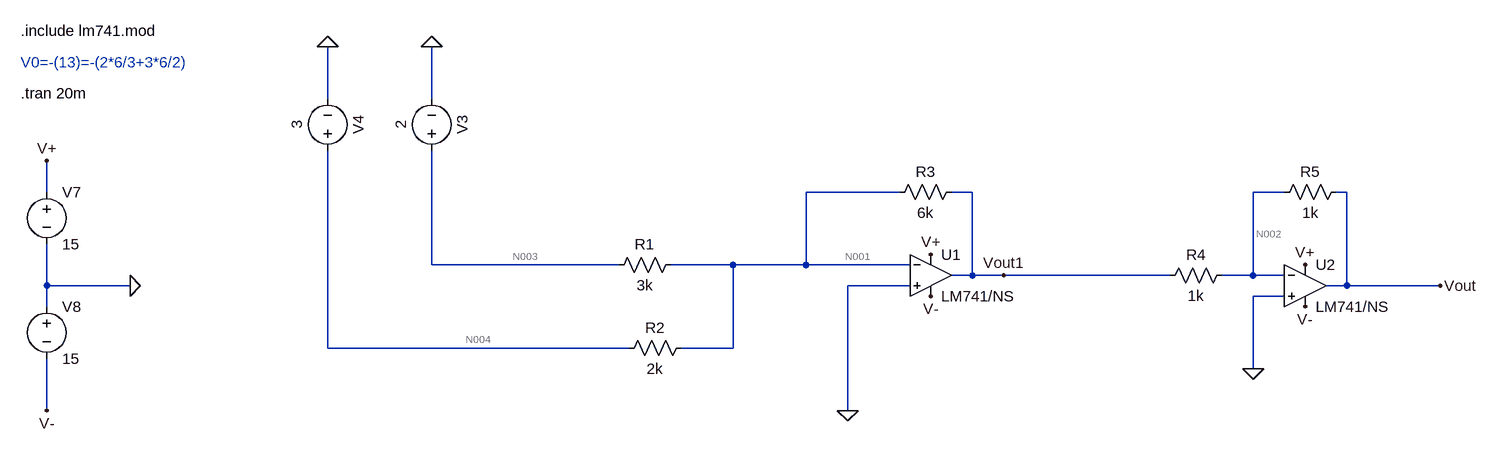
[diagram p0: schematic Scaling adder.asc]
Scaling adder.asc, the LTspice schematic file:
Version 4
SHEET 1 1016 680
WIRE -768 -144 -768 -224
WIRE -608 -144 -608 -224
WIRE -1200 0 -1200 -48
WIRE 112 0 -32 0
WIRE 224 0 192 0
WIRE 704 0 656 0
WIRE 800 0 784 0
WIRE -608 112 -608 -64
WIRE -320 112 -608 112
WIRE -144 112 -240 112
WIRE -32 112 -32 0
WIRE -32 112 -144 112
WIRE 128 112 -32 112
WIRE 224 128 224 0
WIRE 224 128 192 128
WIRE 272 128 224 128
WIRE 528 128 272 128
WIRE 656 128 656 0
WIRE 656 128 608 128
WIRE 704 128 656 128
WIRE -1200 144 -1200 80
WIRE -1072 144 -1200 144
WIRE 128 144 32 144
WIRE 800 144 800 0
WIRE 800 144 768 144
WIRE 944 144 800 144
WIRE 704 160 656 160
WIRE -1200 176 -1200 144
WIRE -768 240 -768 -64
WIRE -304 240 -768 240
WIRE -144 240 -144 112
WIRE -144 240 -224 240
WIRE 656 272 656 160
WIRE -1200 336 -1200 256
WIRE 32 336 32 144
FLAG 272 128 Vout1
FLAG 32 336 0
FLAG -608 -224 0
FLAG -768 -224 0
FLAG 656 272 0
FLAG 944 144 Vout
FLAG -1072 144 0
FLAG 160 96 V+
FLAG -1200 -48 V+
FLAG -1200 336 V-
FLAG 160 160 V-
FLAG 736 176 V-
FLAG 736 112 V+
SYMBOL OpAmps\\opamp2 160 64 R0
SYMATTR InstName U1
SYMATTR Value LM741/NS
SYMBOL res -224 96 R90
WINDOW 0 0 56 VBottom 2
WINDOW 3 32 56 VTop 2
SYMATTR InstName R1
SYMATTR Value 3k
SYMBOL res -208 224 R90
WINDOW 0 0 56 VBottom 2
WINDOW 3 32 56 VTop 2
SYMATTR InstName R2
SYMATTR Value 2k
SYMBOL voltage -608 -48 R180
WINDOW 0 -32 56 VBottom 2
WINDOW 3 32 56 VTop 2
WINDOW 123 0 0 Left 0
WINDOW 39 0 0 Left 0
SYMATTR InstName V3
SYMATTR Value 2
SYMBOL voltage -768 -48 R180
WINDOW 0 -32 56 VBottom 2
WINDOW 3 32 56 VTop 2
WINDOW 123 0 0 Left 0
WINDOW 39 0 0 Left 0
SYMATTR InstName V4
SYMATTR Value 3
SYMBOL res 208 -16 R90
WINDOW 0 0 56 VBottom 2
WINDOW 3 32 56 VTop 2
SYMATTR InstName R3
SYMATTR Value 6k
SYMBOL OpAmps\\opamp2 736 80 R0
SYMATTR InstName U2
SYMATTR Value LM741/NS
SYMBOL res 624 112 R90
WINDOW 0 0 56 VBottom 2
WINDOW 3 32 56 VTop 2
SYMATTR InstName R4
SYMATTR Value 1k
SYMBOL res 800 -16 R90
WINDOW 0 0 56 VBottom 2
WINDOW 3 32 56 VTop 2
SYMATTR InstName R5
SYMATTR Value 1k
SYMBOL voltage -1200 -16 R0
WINDOW 123 0 0 Left 0
WINDOW 39 0 0 Left 0
SYMATTR InstName V7
SYMATTR Value 15
SYMBOL voltage -1200 160 R0
WINDOW 123 0 0 Left 0
WINDOW 39 0 0 Left 0
SYMATTR InstName V8
SYMATTR Value 15
TEXT -1240 -152 Left 2 !.tran 20m
TEXT -1240 -248 Left 2 !.include lm741.mod
TEXT -1240 -200 Left 2 ;V0=-(13)=-(2*6/3+3*6/2)

The netlist it stands for:
* Scaling adder.asc
XU1 0 N001 V+ V- Vout1 LM741/NS  ; pins In+ In- V+ V- OUT
R1 N001 N003 3k
R2 N001 N004 2k
V3 N003 0 2
V4 N004 0 3
R3 Vout1 N001 6k
XU2 0 N002 V+ V- Vout LM741/NS  ; pins In+ In- V+ V- OUT
R4 N002 Vout1 1k
R5 Vout N002 1k
V7 V+ 0 15
V8 0 V- 15
.tran 20m
.include lm741.mod
* V0=-(13)=-(2*6/3+3*6/2)
.backanno
.end

* Results of the author's LTspice run, read from the files saved beside the schematic
* Operating Point, zero values left out:
*   V(n001) = 1.068 mV
*   V(v-) = -15 V
*   V(v+) = 15 V
*   V(vout1) = -12.99 V
*   V(n003) = 2 V
*   V(n004) = 3 V
*   V(n002) = 932.8 µV
*   V(vout) = 12.99 V
*   I(R1) = -666.3 µA
*   I(R2) = -1.499 mA
*   I(R3) = -2.166 mA
*   I(R4) = 12.99 mA
*   I(R5) = 12.99 mA
*   I(V3) = -666.3 µA
*   I(V4) = -1.499 mA
*   I(V7) = -16.24 mA
*   I(V8) = -18.41 mA
*   Ix(u1:1) = 57.62 nA
*   Ix(u1:2) = 102.1 nA
*   Ix(u1:99) = 1.625 mA
*   Ix(u1:50) = -16.78 mA
*   Ix(u1:28) = 15.16 mA
*   Ix(u2:1) = 58.1 nA
*   Ix(u2:2) = 101.6 nA
*   Ix(u2:99) = 14.62 mA
*   Ix(u2:50) = -1.625 mA
*   Ix(u2:28) = -12.99 mA